# Altium schematic sheet GaN_Single_Bridge.SchDoc: GaN_Single_Bridge
size A4; Author: Jisaye; Engineer: Jisaye; Address1: ShenZhen University; Revision: V1.0; SheetNumber: 1; SheetTotal: 1
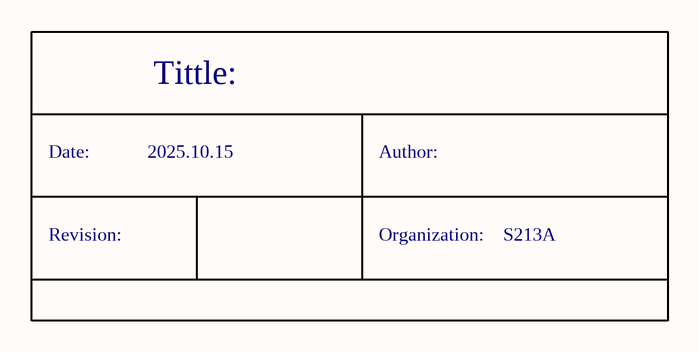
[diagram p0: GaN_Single_Bridge.SchDoc]

## Notes on the sheet
- Tittle:
- Date:
- 2025.10.15
- Author:
- Revision:
- Organization:
- S213A
- THIS DOCUMENT AND THE DATA DISCLOSED HEREIN OR
- HEREWITH IS THE PROPERTY OF ALTIUM LIMITED AND MAY
- DWG NO:
- REVISION
- REV:
- DESCRIPTION
- DATE
- APPROVED
- BE FREELY DISTRIBUTED IN WHOLE. NO RIGHTS ARE
- RESERVED OR EXPRESS OR IMPLIED WARANTEE GIVEN.
- ENG:
- APPROVALS
- PROJECT
- DSN:
- CHK:
- REFERENCE DOCUMENTS
- PROJECT REVISION:
- TITLE
- DOCUMENT REVISION:
- DESIGN ITEM:
- BOM:
- FAB DWG:
- PCB DWG:
- ASSY DWG:
- SCALE:
- A3
- SIZE
- CAGE CODE
- FILE NAME
- DWG NO.
- SHEET
- OF
- REV